# Altium schematic sheet 16_LPDDR.SchDoc
size A3; SheetNumber: 17; SheetTotal: 22
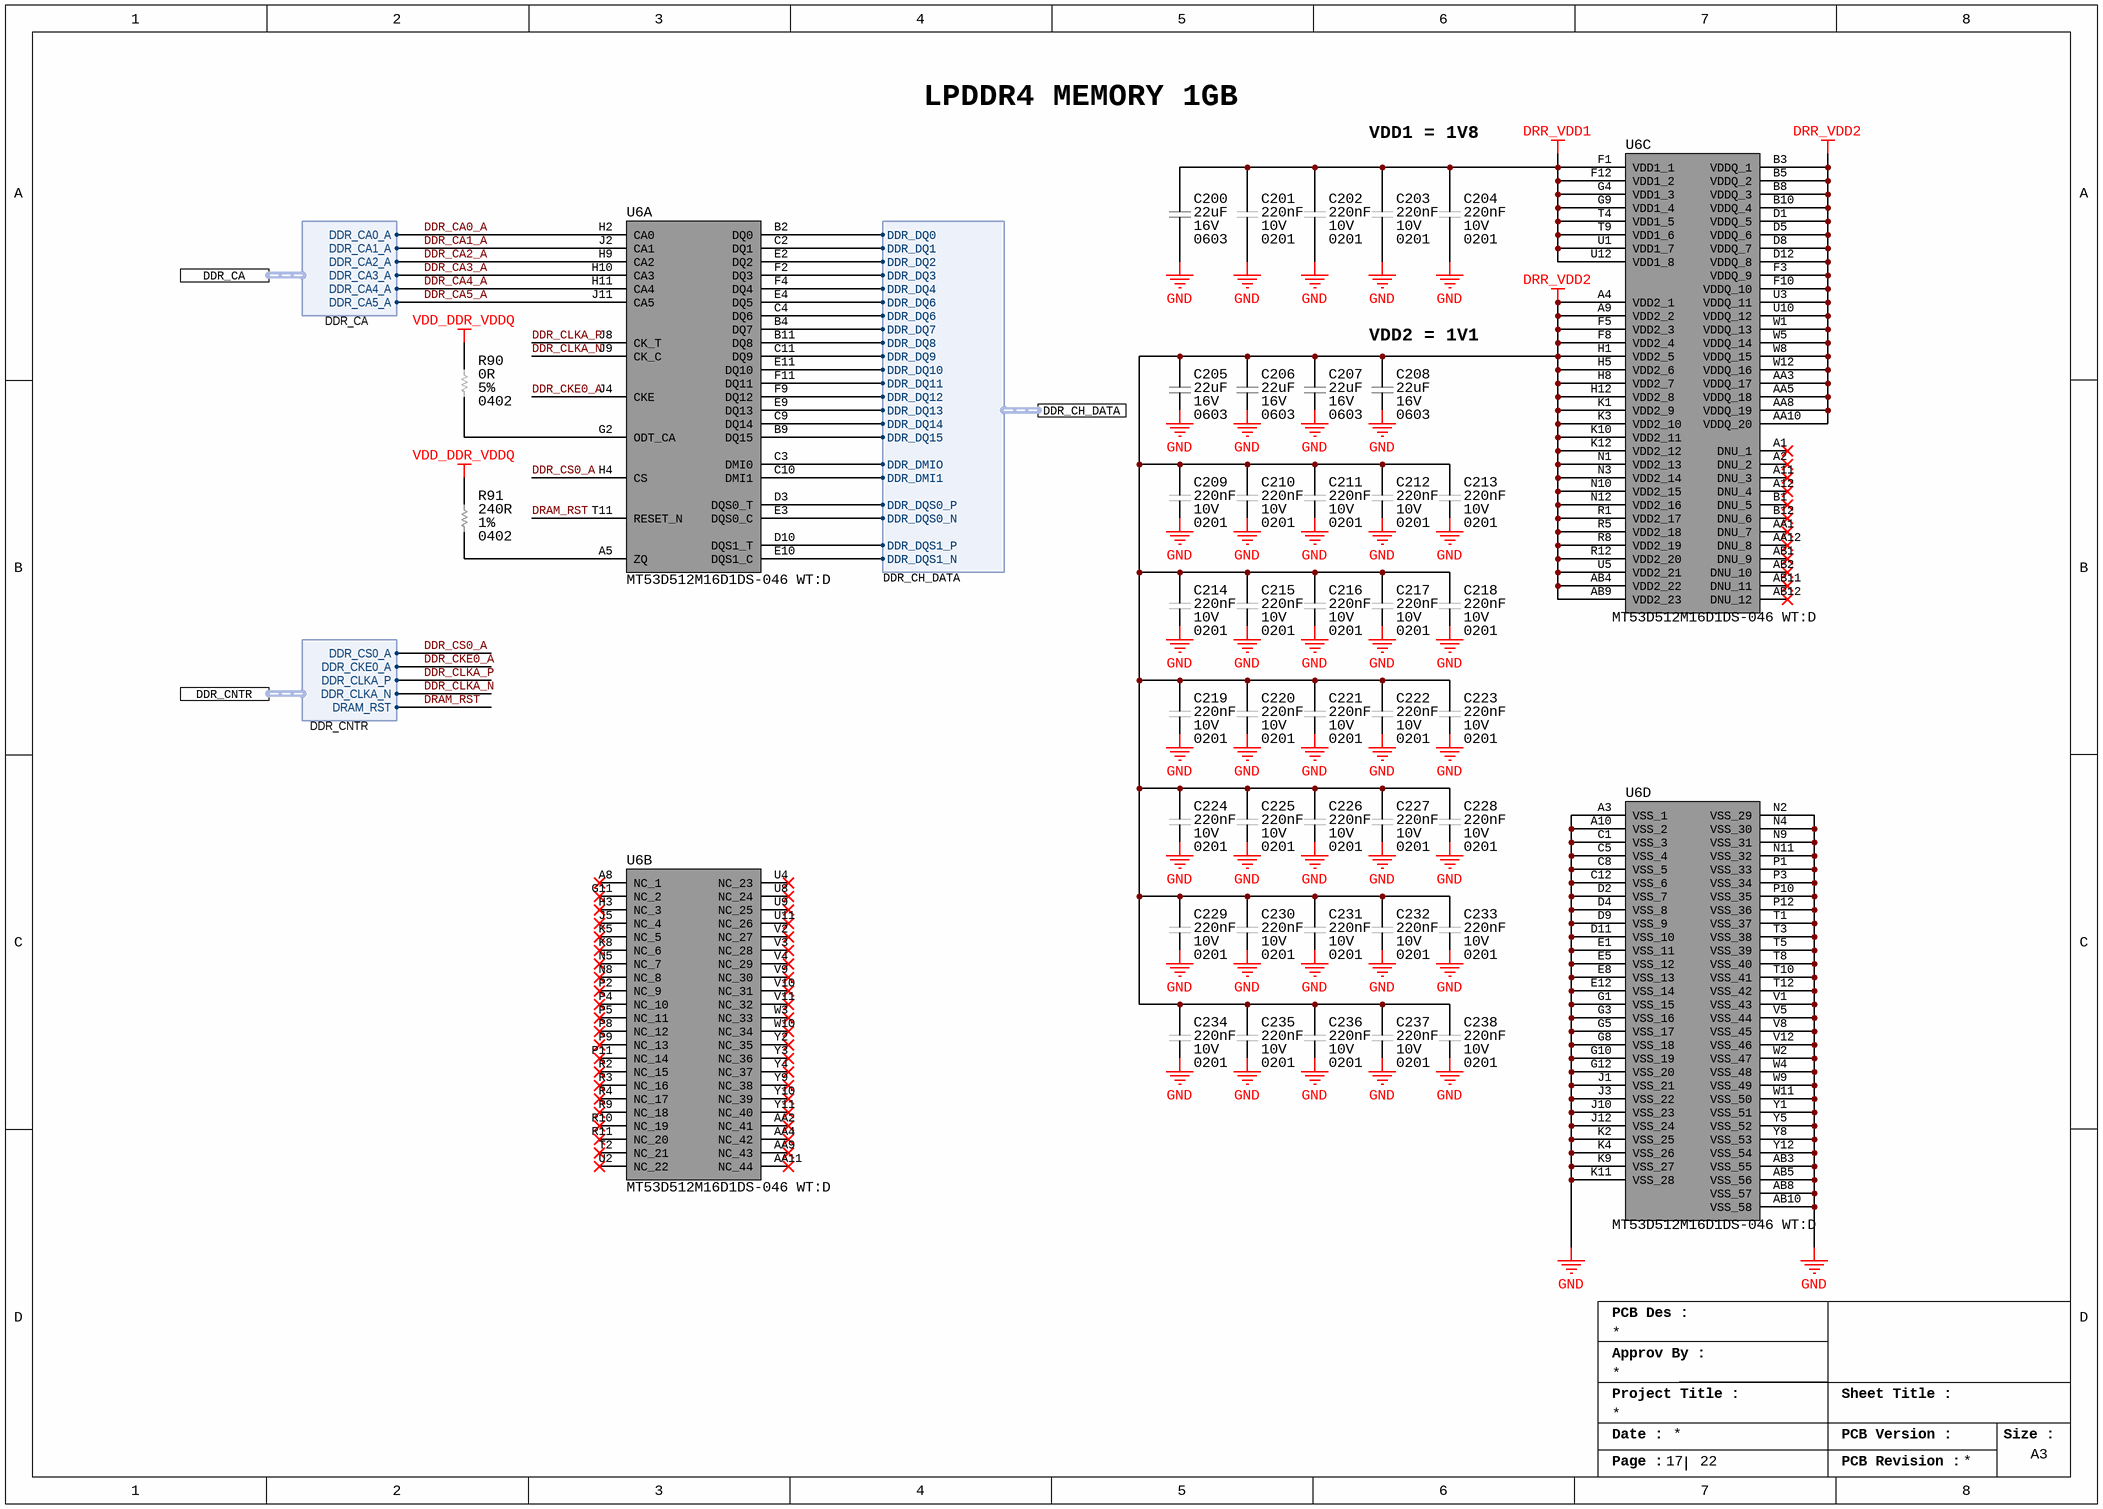
[diagram p0: 16_LPDDR.SchDoc]

## Parts
C200  Capacitance: 22uF  Voltage Rating: 16V  Case/Package: 0603  [CAP_0603_CAPC1608X08N]  (hidden comment: CL10A226MO7JZNC)
C201  Voltage Rating (DC): 10V  Capacitance: 220nF  Case/Package: 0201  [CAP_0201_CAPC0603X03N]  (hidden comment: LMK063BJ224MP-F)
C202  Voltage Rating (DC): 10V  Capacitance: 220nF  Case/Package: 0201  [CAP_0201_CAPC0603X03N]  (hidden comment: LMK063BJ224MP-F)
C203  Voltage Rating (DC): 10V  Capacitance: 220nF  Case/Package: 0201  [CAP_0201_CAPC0603X03N]  (hidden comment: LMK063BJ224MP-F)
C204  Voltage Rating (DC): 10V  Capacitance: 220nF  Case/Package: 0201  [CAP_0201_CAPC0603X03N]  (hidden comment: LMK063BJ224MP-F)
C205  Capacitance: 22uF  Voltage Rating: 16V  Case/Package: 0603  [CAP_0603_CAPC1608X08N]  (hidden comment: CL10A226MO7JZNC)
C206  Capacitance: 22uF  Voltage Rating: 16V  Case/Package: 0603  [CAP_0603_CAPC1608X08N]  (hidden comment: CL10A226MO7JZNC)
C207  Capacitance: 22uF  Voltage Rating: 16V  Case/Package: 0603  [CAP_0603_CAPC1608X08N]  (hidden comment: CL10A226MO7JZNC)
C208  Capacitance: 22uF  Voltage Rating: 16V  Case/Package: 0603  [CAP_0603_CAPC1608X08N]  (hidden comment: CL10A226MO7JZNC)
C209  Voltage Rating (DC): 10V  Capacitance: 220nF  Case/Package: 0201  [CAP_0201_CAPC0603X03N]  (hidden comment: LMK063BJ224MP-F)
C210  Voltage Rating (DC): 10V  Capacitance: 220nF  Case/Package: 0201  [CAP_0201_CAPC0603X03N]  (hidden comment: LMK063BJ224MP-F)
C211  Voltage Rating (DC): 10V  Capacitance: 220nF  Case/Package: 0201  [CAP_0201_CAPC0603X03N]  (hidden comment: LMK063BJ224MP-F)
C212  Voltage Rating (DC): 10V  Capacitance: 220nF  Case/Package: 0201  [CAP_0201_CAPC0603X03N]  (hidden comment: LMK063BJ224MP-F)
C213  Voltage Rating (DC): 10V  Capacitance: 220nF  Case/Package: 0201  [CAP_0201_CAPC0603X03N]  (hidden comment: LMK063BJ224MP-F)
C214  Voltage Rating (DC): 10V  Capacitance: 220nF  Case/Package: 0201  [CAP_0201_CAPC0603X03N]  (hidden comment: LMK063BJ224MP-F)
C215  Voltage Rating (DC): 10V  Capacitance: 220nF  Case/Package: 0201  [CAP_0201_CAPC0603X03N]  (hidden comment: LMK063BJ224MP-F)
C216  Voltage Rating (DC): 10V  Capacitance: 220nF  Case/Package: 0201  [CAP_0201_CAPC0603X03N]  (hidden comment: LMK063BJ224MP-F)
C217  Voltage Rating (DC): 10V  Capacitance: 220nF  Case/Package: 0201  [CAP_0201_CAPC0603X03N]  (hidden comment: LMK063BJ224MP-F)
C218  Voltage Rating (DC): 10V  Capacitance: 220nF  Case/Package: 0201  [CAP_0201_CAPC0603X03N]  (hidden comment: LMK063BJ224MP-F)
C219  Voltage Rating (DC): 10V  Capacitance: 220nF  Case/Package: 0201  [CAP_0201_CAPC0603X03N]  (hidden comment: LMK063BJ224MP-F)
C220  Voltage Rating (DC): 10V  Capacitance: 220nF  Case/Package: 0201  [CAP_0201_CAPC0603X03N]  (hidden comment: LMK063BJ224MP-F)
C221  Voltage Rating (DC): 10V  Capacitance: 220nF  Case/Package: 0201  [CAP_0201_CAPC0603X03N]  (hidden comment: LMK063BJ224MP-F)
C222  Voltage Rating (DC): 10V  Capacitance: 220nF  Case/Package: 0201  [CAP_0201_CAPC0603X03N]  (hidden comment: LMK063BJ224MP-F)
C223  Voltage Rating (DC): 10V  Capacitance: 220nF  Case/Package: 0201  [CAP_0201_CAPC0603X03N]  (hidden comment: LMK063BJ224MP-F)
C224  Voltage Rating (DC): 10V  Capacitance: 220nF  Case/Package: 0201  [CAP_0201_CAPC0603X03N]  (hidden comment: LMK063BJ224MP-F)
C225  Voltage Rating (DC): 10V  Capacitance: 220nF  Case/Package: 0201  [CAP_0201_CAPC0603X03N]  (hidden comment: LMK063BJ224MP-F)
C226  Voltage Rating (DC): 10V  Capacitance: 220nF  Case/Package: 0201  [CAP_0201_CAPC0603X03N]  (hidden comment: LMK063BJ224MP-F)
C227  Voltage Rating (DC): 10V  Capacitance: 220nF  Case/Package: 0201  [CAP_0201_CAPC0603X03N]  (hidden comment: LMK063BJ224MP-F)
C228  Voltage Rating (DC): 10V  Capacitance: 220nF  Case/Package: 0201  [CAP_0201_CAPC0603X03N]  (hidden comment: LMK063BJ224MP-F)
C229  Voltage Rating (DC): 10V  Capacitance: 220nF  Case/Package: 0201  [CAP_0201_CAPC0603X03N]  (hidden comment: LMK063BJ224MP-F)
C230  Voltage Rating (DC): 10V  Capacitance: 220nF  Case/Package: 0201  [CAP_0201_CAPC0603X03N]  (hidden comment: LMK063BJ224MP-F)
C231  Voltage Rating (DC): 10V  Capacitance: 220nF  Case/Package: 0201  [CAP_0201_CAPC0603X03N]  (hidden comment: LMK063BJ224MP-F)
C232  Voltage Rating (DC): 10V  Capacitance: 220nF  Case/Package: 0201  [CAP_0201_CAPC0603X03N]  (hidden comment: LMK063BJ224MP-F)
C233  Voltage Rating (DC): 10V  Capacitance: 220nF  Case/Package: 0201  [CAP_0201_CAPC0603X03N]  (hidden comment: LMK063BJ224MP-F)
C234  Voltage Rating (DC): 10V  Capacitance: 220nF  Case/Package: 0201  [CAP_0201_CAPC0603X03N]  (hidden comment: LMK063BJ224MP-F)
C235  Voltage Rating (DC): 10V  Capacitance: 220nF  Case/Package: 0201  [CAP_0201_CAPC0603X03N]  (hidden comment: LMK063BJ224MP-F)
C236  Voltage Rating (DC): 10V  Capacitance: 220nF  Case/Package: 0201  [CAP_0201_CAPC0603X03N]  (hidden comment: LMK063BJ224MP-F)
C237  Voltage Rating (DC): 10V  Capacitance: 220nF  Case/Package: 0201  [CAP_0201_CAPC0603X03N]  (hidden comment: LMK063BJ224MP-F)
C238  Voltage Rating (DC): 10V  Capacitance: 220nF  Case/Package: 0201  [CAP_0201_CAPC0603X03N]  (hidden comment: LMK063BJ224MP-F)
R90  Case Code (Imperial): 0402  Tolerance: 5%  Resistance: 0R  [RES_0402_RESC1005X04N]  (hidden comment: ERJ-2GE0R00X)
R91  Tolerance: 1%  Resistance: 240R  Case/Package: 0402  [RES_0402_RESC1005X04N]  (hidden comment: RC0402FR-07240RL)
U6  MT53D512M16D1DS-046 WT:D  [BGA200C65P12X22_1000X1450X80]  (parts A,B,C,D of 4)

## Ports
DDR_CA (harness DDR_CA), DDR_CH_DATA (harness DDR_CH_DATA), DDR_CNTR (harness DDR_CNTR)

## Harnesses
DDR_CH_DATA: DDR_DQ0, DDR_DQ1, DDR_DQ2, DDR_DQ3, DDR_DQ4, DDR_DQ6, DDR_DQ6, DDR_DQ7, DDR_DQS0_P, DDR_DQS0_N, DDR_DMIO, DDR_DQ8, DDR_DQ9, DDR_DQ10, DDR_DQ11, DDR_DQ12, DDR_DQ13, DDR_DQ14, DDR_DQ15, DDR_DQS1_P, DDR_DQS1_N, DDR_DMI1
DDR_CA: DDR_CA0_A, DDR_CA1_A, DDR_CA2_A, DDR_CA3_A, DDR_CA4_A, DDR_CA5_A
DDR_CNTR: DDR_CS0_A, DDR_CKE0_A, DDR_CLKA_P, DDR_CLKA_N, DRAM_RST

## Nets
DRR_VDD1: C200.2 C201.1 C202.1 C203.1 C204.1 U6.F1(VDD1_1) U6.F12(VDD1_2) U6.G4(VDD1_3) U6.G9(VDD1_4) U6.T4(VDD1_5) U6.T9(VDD1_6) U6.U1(VDD1_7) U6.U12(VDD1_8)
DRR_VDD2: C205.2 C206.2 C207.2 C208.2 C209.1 C210.1 C211.1 C212.1 C213.1 C214.1 C215.1 C216.1 C217.1 C218.1 C219.1 C220.1 C221.1 C222.1 C223.1 C224.1 C225.1 C226.1 C227.1 C228.1 C229.1 C230.1 C231.1 C232.1 C233.1 C234.1 C235.1 C236.1 C237.1 C238.1 U6.A4(VDD2_1) U6.A9(VDD2_2) U6.AA3(VDDQ_17) U6.AA5(VDDQ_18) U6.AA8(VDDQ_19) U6.AA10(VDDQ_20) U6.AB4(VDD2_22) U6.AB9(VDD2_23) U6.B3(VDDQ_1) U6.B5(VDDQ_2) U6.B8(VDDQ_3) U6.B10(VDDQ_4) U6.D1(VDDQ_5) U6.D5(VDDQ_6) U6.D8(VDDQ_7) U6.D12(VDDQ_8) U6.F3(VDDQ_9) U6.F5(VDD2_3) U6.F8(VDD2_4) U6.F10(VDDQ_10) U6.H1(VDD2_5) U6.H5(VDD2_6) U6.H8(VDD2_7) U6.H12(VDD2_8) U6.K1(VDD2_9) U6.K3(VDD2_10) U6.K10(VDD2_11) U6.K12(VDD2_12) U6.N1(VDD2_13) U6.N3(VDD2_14) U6.N10(VDD2_15) U6.N12(VDD2_16) U6.R1(VDD2_17) U6.R5(VDD2_18) U6.R8(VDD2_19) U6.R12(VDD2_20) U6.U3(VDDQ_11) U6.U5(VDD2_21) U6.U10(VDDQ_12) U6.W1(VDDQ_13) U6.W5(VDDQ_14) U6.W8(VDDQ_15) U6.W12(VDDQ_16)
GND: C200.1 C201.2 C202.2 C203.2 C204.2 C205.1 C206.1 C207.1 C208.1 C209.2 C210.2 C211.2 C212.2 C213.2 C214.2 C215.2 C216.2 C217.2 C218.2 C219.2 C220.2 C221.2 C222.2 C223.2 C224.2 C225.2 C226.2 C227.2 C228.2 C229.2 C230.2 C231.2 C232.2 C233.2 C234.2 C235.2 C236.2 C237.2 C238.2 U6.A3(VSS_1) U6.A10(VSS_2) U6.AB3(VSS_55) U6.AB5(VSS_56) U6.AB8(VSS_57) U6.AB10(VSS_58) U6.C1(VSS_3) U6.C5(VSS_4) U6.C8(VSS_5) U6.C12(VSS_6) U6.D2(VSS_7) U6.D4(VSS_8) U6.D9(VSS_9) U6.D11(VSS_10) U6.E1(VSS_11) U6.E5(VSS_12) U6.E8(VSS_13) U6.E12(VSS_14) U6.G1(VSS_15) U6.G3(VSS_16) U6.G5(VSS_17) U6.G8(VSS_18) U6.G10(VSS_19) U6.G12(VSS_20) U6.J1(VSS_21) U6.J3(VSS_22) U6.J10(VSS_23) U6.J12(VSS_24) U6.K2(VSS_25) U6.K4(VSS_26) U6.K9(VSS_27) U6.K11(VSS_28) U6.N2(VSS_29) U6.N4(VSS_30) U6.N9(VSS_31) U6.N11(VSS_32) U6.P1(VSS_33) U6.P3(VSS_34) U6.P10(VSS_35) U6.P12(VSS_36) U6.T1(VSS_37) U6.T3(VSS_38) U6.T5(VSS_39) U6.T8(VSS_40) U6.T10(VSS_41) U6.T12(VSS_42) U6.V1(VSS_43) U6.V5(VSS_44) U6.V8(VSS_45) U6.V12(VSS_46) U6.W2(VSS_47) U6.W4(VSS_48) U6.W9(VSS_49) U6.W11(VSS_50) U6.Y1(VSS_51) U6.Y5(VSS_52) U6.Y8(VSS_53) U6.Y12(VSS_54)
VDD_DDR_VDDQ: R90.2 R91.2
DDR_CA0_A: U6.H2(CA0) ; port DDR_CA.DDR_CA0_A
DDR_CA1_A: U6.J2(CA1) ; port DDR_CA.DDR_CA1_A
DDR_CA2_A: U6.H9(CA2) ; port DDR_CA.DDR_CA2_A
DDR_CA3_A: U6.H10(CA3) ; port DDR_CA.DDR_CA3_A
DDR_CA4_A: U6.H11(CA4) ; port DDR_CA.DDR_CA4_A
DDR_CA5_A: U6.J11(CA5) ; port DDR_CA.DDR_CA5_A
DDR_CKE0_A: U6.J4(CKE) ; port DDR_CNTR.DDR_CKE0_A
DDR_CLKA_N: U6.J9(CK_C) ; port DDR_CNTR.DDR_CLKA_N
DDR_CLKA_P: U6.J8(CK_T) ; port DDR_CNTR.DDR_CLKA_P
DDR_CS0_A: U6.H4(CS) ; port DDR_CNTR.DDR_CS0_A
DRAM_RST: U6.T11(RESET_N) ; port DDR_CNTR.DRAM_RST
NetR90_1: R90.1 U6.G2(ODT_CA)
NetR91_1: R91.1 U6.A5(ZQ)
NetU6_B2: U6.B2(DQ0) ; port DDR_CH_DATA.DDR_DQ0
NetU6_B4: U6.B4(DQ7) ; port DDR_CH_DATA.DDR_DQ7
NetU6_B9: U6.B9(DQ15) ; port DDR_CH_DATA.DDR_DQ15
NetU6_B11: U6.B11(DQ8) ; port DDR_CH_DATA.DDR_DQ8
NetU6_C2: U6.C2(DQ1) ; port DDR_CH_DATA.DDR_DQ1
NetU6_C3: U6.C3(DMI0) ; port DDR_CH_DATA.DDR_DMIO
NetU6_C4: U6.C4(DQ6) U6.E4(DQ5) ; port DDR_CH_DATA.DDR_DQ6
NetU6_C9: U6.C9(DQ14) ; port DDR_CH_DATA.DDR_DQ14
NetU6_C10: U6.C10(DMI1) ; port DDR_CH_DATA.DDR_DMI1
NetU6_C11: U6.C11(DQ9) ; port DDR_CH_DATA.DDR_DQ9
NetU6_D3: U6.D3(DQS0_T) ; port DDR_CH_DATA.DDR_DQS0_P
NetU6_D10: U6.D10(DQS1_T) ; port DDR_CH_DATA.DDR_DQS1_P
NetU6_E2: U6.E2(DQ2) ; port DDR_CH_DATA.DDR_DQ2
NetU6_E3: U6.E3(DQS0_C) ; port DDR_CH_DATA.DDR_DQS0_N
NetU6_E9: U6.E9(DQ13) ; port DDR_CH_DATA.DDR_DQ13
NetU6_E10: U6.E10(DQS1_C) ; port DDR_CH_DATA.DDR_DQS1_N
NetU6_E11: U6.E11(DQ10) ; port DDR_CH_DATA.DDR_DQ10
NetU6_F2: U6.F2(DQ3) ; port DDR_CH_DATA.DDR_DQ3
NetU6_F4: U6.F4(DQ4) ; port DDR_CH_DATA.DDR_DQ4
NetU6_F9: U6.F9(DQ12) ; port DDR_CH_DATA.DDR_DQ12
NetU6_F11: U6.F11(DQ11) ; port DDR_CH_DATA.DDR_DQ11

Not connected (* = marked no-connect by the designer): U6 A1(DNU_1)* A2(DNU_2)* A8(NC_1)* A11(DNU_3)* A12(DNU_4)* AA1(DNU_7)* AA2(NC_41)* AA4(NC_42)* AA9(NC_43)* AA11(NC_44)* AA12(DNU_8)* AB1(DNU_9)* AB2(DNU_10)* AB11(DNU_11)* AB12(DNU_12)* B1(DNU_5)* B12(DNU_6)* G11(NC_2)* H3(NC_3)* J5(NC_4)* K5(NC_5)* K8(NC_6)* N5(NC_7)* N8(NC_8)* P2(NC_9)* P4(NC_10)* P5(NC_11)* P8(NC_12)* P9(NC_13)* P11(NC_14)* R2(NC_15)* R3(NC_16)* R4(NC_17)* R9(NC_18)* R10(NC_19)* R11(NC_20)* T2(NC_21)* U2(NC_22)* U4(NC_23)* U8(NC_24)* U9(NC_25)* U11(NC_26)* V2(NC_27)* V3(NC_28)* V4(NC_29)* V9(NC_30)* V10(NC_31)* V11(NC_32)* W3(NC_33)* W10(NC_34)* Y2(NC_35)* Y3(NC_36)* Y4(NC_37)* Y9(NC_38)* Y10(NC_39)* Y11(NC_40)*

## Notes on the sheet
- LPDDR4 MEMORY 1GB
- VDD1 = 1V8
- (near C208) VDD2 = 1V1
- PCB Des :
- Approv By :
- Project Title :
- Sheet Title :
- Date :
- PCB Version :
- Size :
- A3
- Page :
- PCB Revision :

## Library data of the parts
C200 C205-C208 = CAP_22UF_16V_X5R_0603: Cap Ceramic 22uF 16V X5R 20% Pad SMD 0603 85C T/R; Manufacturer: Samsung; Supplier 1: Digi-Key; Manufacturer Part Number: CL10A226MO7JZNC; RoHS: Yes; Category: Ceramic Capacitors; Stock 1: 1760065; Pricing 1: 1=0.59, 10=0.419, 50=0.3164, 100=0.2756, 500=0.20418, 1000=0.17355 (USD); Mount: Surface Mount; Case Code (Imperial): 0603; Case Code (Metric): 1608; Min Operating Temperature: -55°C; Max Operating Temperature: 85°C; Packaging: Cut Tape; Tolerance: 20%; Series: CL; RoHS Compliant: Yes; ComponentLink1URL: http://www.samsungsem.com/kr/support/product-search/mlcc/CL10A226MO7JZNC.jsp?src-supplier=Digi-Key; ComponentLink1Description: http://www.samsungsem.com/kr/support/product-search/mlcc/CL10A226MO7JZNC.jsp?src-supplier=Digi-Key; ComponentLink2URL: https://datasheet.octopart.com/CL10A226MO7JZNC-Samsung-Electro-Mechanics-datasheet-149156497.pdf?src-supplier=Future+Electronics; ComponentLink2Description: https://datasheet.octopart.com/CL10A226MO7JZNC-Samsung-Electro-Mechanics-datasheet-149156497.pdf?src-supplier=Future+Electronics; Supplier Part Number 1: 1276-7076-1-ND
C201-C204 C209-C238 = CAP_0.22UF_10V_X5R_0201: Multilayer Ceramic Capacitors (High dielectric type), 10V, 0.22 uF, ± 20 %, 0201, X5R, RoHS; Manufacturer: Taiyo Yuden; Material: 4241ConductorMaterial; Tolerance: 20%; Supplier 1: Digikey; Manufacturer Part Number: LMK063BJ224MP-F; RoHS: Yes; Category: Ceramic Capacitors; Stock 1: 6053224; Pricing 1: 1=0.12, 10=0.08, 50=0.0478, 100=0.0375, 500=0.02772, 1000=0.02295, 2500=0.02136, 5000=0.01954 (USD); Mount: Surface Mount; Case Code (Metric): 0603; Case Code (Imperial): 0201; Min Operating Temperature: -55°C; Max Operating Temperature: 85°C; Voltage Rating: 10V; Packaging: Tape and Reel; Package Quantity: 15000; Dielectric: X5R; Termination: SMD/SMT; Voltage: 10V; Series: M; Construction: Flat; Length: 0.6mm; Width: 0.3mm; Height: 0.3mm; Depth: 0.3mm; Radiation Hardening: No; Halogen Free: Halogen Free; RoHS Compliant: Yes; Reach SVHC Compliant: Unknown; ComponentLink1URL: https://datasheet.ciiva.com/134/lmk063bj224mp-f-ss-134995.pdf?src-supplier=Digikey; ComponentLink1Description: https://datasheet.ciiva.com/134/lmk063bj224mp-f-ss-134995.pdf?src-supplier=Digikey; ComponentLink2URL: https://datasheet.ciiva.com/11464/lmk063bj224mp-f-ss-11464053.pdf?src-supplier=Avnet; ComponentLink2Description: https://datasheet.ciiva.com/11464/lmk063bj224mp-f-ss-11464053.pdf?src-supplier=Avnet; ComponentLink3URL: https://datasheet.ciiva.com/15921/1589lmk063bj224mp-f-15921250.pdf?src-supplier=Onlinecomponents.com; ComponentLink3Description: https://datasheet.ciiva.com/15921/1589lmk063bj224mp-f-15921250.pdf?src-supplier=Onlinecomponents.com; ComponentLink4URL: https://datasheet.ciiva.com/26872/getdatasheetpartid-639019-26872592.pdf?src-supplier=Verical; ComponentLink4Description: https://datasheet.ciiva.com/26872/getdatasheetpartid-639019-26872592.pdf?src-supplier=Verical; ComponentLink5URL: https://datasheet.ciiva.com/30243/100lmk063bj224mp-f-30243150.pdf?src-supplier=Onlinecomponents.com; ComponentLink5Description: https://datasheet.ciiva.com/30243/100lmk063bj224mp-f-30243150.pdf?src-supplier=Onlinecomponents.com; ComponentLink6URL: https://datasheet.ciiva.com/28645/746258-28645141.pdf?src-supplier=Element14; ComponentLink6Description: https://datasheet.ciiva.com/28645/746258-28645141.pdf?src-supplier=Element14; ComponentLink7URL: https://datasheet.ciiva.com/5422/mlcc-all-e-541559-5422365.pdf?src-supplier=Mouser; ComponentLink7Description: https://datasheet.ciiva.com/5422/mlcc-all-e-541559-5422365.pdf?src-supplier=Mouser; Supplier Part Number 1: 587-2483-1-ND
R90 = RES_0R_5%_100mW_0402: SMD Chip Resistor, Jumper, 0 ohm, 100 mW, 0402 [1005 Metric], Thick Film, General Purpose; Manufacturer: Panasonic; Power Rating: 100mW; Voltage Rating: 50V; Temperature Coefficient: 600ppm/°C; Supplier 1: Mouser; Manufacturer Part Number: ERJ-2GE0R00X; RoHS: Yes; Category: Chip SMD Resistors; Stock 1: 10989354; Pricing 1: 1=0.1, 10=0.013, 50=0.013, 100=0.006, 1000=0.004, 2500=0.003, 10000=0.003 (USD); Mount: Surface Mount; Case/Package: 0402; Contact Plating: Tin; Case Code (Metric): 1005; Size Code: 0402; Min Operating Temperature: -55°C; Max Operating Temperature: 155°C; Resistor Type: Thick Film; Packaging: Cut Tape; Package Quantity: 10000; Number of Terminations: 2; Termination: SMD/SMT; Max Power Dissipation: 100mW; Voltage Rating (DC): 50V; Features: Automotive AEC-Q200; Series: ERJ; Construction: Rectangular; Technology: THICK FILM; Length: 1mm; Width: 0.5mm; Height: 0.35mm; Depth: 0.5mm; Ratings: AEC-Q200; Radiation Hardening: No; Reach SVHC Compliant: No; Military Standard: Not; Lead Free: Lead Free; RoHS Compliant: Yes; ComponentLink1URL: https://datasheet.ciiva.com/11821/0900766b80f806dd-11821176.pdf?src-supplier=Rs; ComponentLink1Description: https://datasheet.ciiva.com/11821/0900766b80f806dd-11821176.pdf?src-supplier=Rs; ComponentLink2URL: https://datasheet.ciiva.com/43460/1678796-43460347.pdf?src-supplier=Farnell; ComponentLink2Description: https://datasheet.ciiva.com/43460/1678796-43460347.pdf?src-supplier=Farnell; ComponentLink3URL: https://datasheet.ciiva.com/46389/1678796-46389518.pdf?src-supplier=Element14; ComponentLink3Description: https://datasheet.ciiva.com/46389/1678796-46389518.pdf?src-supplier=Element14; ComponentLink4URL: https://datasheet.ciiva.com/5959/1678796-5959692.pdf?src-supplier=Farnell; ComponentLink4Description: https://datasheet.ciiva.com/5959/1678796-5959692.pdf?src-supplier=Farnell; ComponentLink5URL: https://datasheet.ciiva.com/28695/1678796-28695758.pdf?src-supplier=Element14; ComponentLink5Description: https://datasheet.ciiva.com/28695/1678796-28695758.pdf?src-supplier=Element14; ComponentLink6URL: https://datasheet.ciiva.com/16783/70260739-16783734.pdf?src-supplier=Allied+Electronics; ComponentLink6Description: https://datasheet.ciiva.com/16783/70260739-16783734.pdf?src-supplier=Allied+Electronics; ComponentLink7URL: https://datasheet.ciiva.com/16778/70260739-16778335.pdf?src-supplier=Allied+Electronics; ComponentLink7Description: https://datasheet.ciiva.com/16778/70260739-16778335.pdf?src-supplier=Allied+Electronics; ComponentLink8URL: https://datasheet.ciiva.com/48531/aoa0000ce1-48531077.pdf?src-supplier=Avnet; ComponentLink8Description: https://datasheet.ciiva.com/48531/aoa0000ce1-48531077.pdf?src-supplier=Avnet; ComponentLink9URL: https://datasheet.ciiva.com/30097/4aoa0000ce1-30097116.pdf?src-supplier=Onlinecomponents.com; ComponentLink9Description: https://datasheet.ciiva.com/30097/4aoa0000ce1-30097116.pdf?src-supplier=Onlinecomponents.com; Supplier Part Number 1: 667-ERJ-2GE0R00X
R91 = RES_240R_1%_63mW_0402: SMD Chip Resistor, 240 Ohm, ± 1%, 63 mW, 0402 [1005 Metric], Thick Film, General Purpose; Manufacturer: Yageo; Power Rating: 63mW; Voltage Rating: 50V; Temperature Coefficient: 100ppm/°C; Supplier 1: Digi-Key; Manufacturer Part Number: RC0402FR-07240RL; RoHS: Yes; Category: Chip SMD Resistors; Stock 1: 1880273; Pricing 1: 1=0.1, 10=0.014, 50=0.0084, 100=0.007, 500=0.00464, 1000=0.00396, 5000=0.00282 (USD); Case Code (Metric): 1005; Case Code (Imperial): 0402; Size Code: 0402; Min Operating Temperature: -55°C; Max Operating Temperature: 155°C; Resistor Type: Thick Film; Packaging: Tape and Reel; Number of Terminations: 2; Termination: SMD/SMT; Max Power Dissipation: 63mW; Voltage Rating (DC): 50V; Features: Moisture Resistant; Series: RC; Construction: Rectangular; Resistance Tolerance: 1%; Length: 1mm; Depth: 0.5mm; RoHS Compliant: Yes; Military Standard: Not; Lead Free: Lead Free; Reach SVHC Compliant: Unknown; ComponentLink1URL: https://datasheet.ciiva.com/7849/1018594-7849915.pdf?src-supplier=Element14; ComponentLink1Description: https://datasheet.ciiva.com/7849/1018594-7849915.pdf?src-supplier=Element14; ComponentLink2URL: https://datasheet.ciiva.com/7849/1018594-7849916.pdf?src-supplier=Element14; ComponentLink2Description: https://datasheet.ciiva.com/7849/1018594-7849916.pdf?src-supplier=Element14; ComponentLink3URL: https://datasheet.ciiva.com/2519/pyu-r-int-thick-7-2519158.pdf?src-supplier=Digi-Key; ComponentLink3Description: https://datasheet.ciiva.com/2519/pyu-r-int-thick-7-2519158.pdf?src-supplier=Digi-Key; ComponentLink4URL: https://datasheet.ciiva.com/2519/pyu-r-int-thick-7-2519157.pdf?src-supplier=Digi-Key; ComponentLink4Description: https://datasheet.ciiva.com/2519/pyu-r-int-thick-7-2519157.pdf?src-supplier=Digi-Key; ComponentLink5URL: https://datasheet.ciiva.com/2519/pyu-r-int-thick-7-2519156.pdf?src-supplier=Digi-Key; ComponentLink5Description: https://datasheet.ciiva.com/2519/pyu-r-int-thick-7-2519156.pdf?src-supplier=Digi-Key; ComponentLink6URL: https://datasheet.ciiva.com/12669/pyu-rc0402-51-rohs-l-6-r-12669689.pdf?src-supplier=Mouser; ComponentLink6Description: https://datasheet.ciiva.com/12669/pyu-rc0402-51-rohs-l-6-r-12669689.pdf?src-supplier=Mouser; ComponentLink7URL: https://datasheet.ciiva.com/17419/pyu-rc0402-51-rohs-l-6-r-17419482.pdf?src-supplier=Future+Electronics; ComponentLink7Description: https://datasheet.ciiva.com/17419/pyu-rc0402-51-rohs-l-6-r-17419482.pdf?src-supplier=Future+Electronics; Supplier Part Number 1: 311-240LRCT-ND
U6 = IC_DRAM_8Gb_MT53D512M16D1DS-046 WT:D: Active Volatile ROHS3Compliant Automotive AEC-Q100 ic memory -30C~85C TC 8Gb 512M x 16 2.133GHz; Manufacturer: Micron Technology; Max Supply Current: 360mA; Max Supply Voltage: 1.17V; Min Supply Voltage: 1.06V; Number of Circuits: 1NUMBER; Operating Supply Voltage: 1.1V; Supplier 1: Digikey; Manufacturer Part Number: MT53D512M16D1DS-046 WT:D; RoHS: No; Category: Memory; Stock 1: 1200; Pricing 1: 1=9.81, 10=9.115, 25=8.834, 50=8.6224, 100=8.4121, 250=8.13712, 500=7.93238 (USD); Mount: Surface Mount; Number of Pins: 200; Min Operating Temperature: -30°C; Max Operating Temperature: 85°C; Memory Type: Volatile; Series: Automotive, AEC-Q100; Packaging: Tray; Memory Size: 8Gb; Frequency: 2.133GHz; Number of Ports: 1NUMBER; Length: 14.5mm; Width: 10mm; Height - Seated (Max): 800um; Terminal Pitch: 800um; Reach SVHC Compliant: 4188SVHC; ComponentLink1URL: https://datasheet.octopart.com/MT53D512M16D1DS-046-WT%3AD-Micron-datasheet-165827613.pdf?src-supplier=Farnell; ComponentLink1Description: https://datasheet.octopart.com/MT53D512M16D1DS-046-WT%3AD-Micron-datasheet-165827613.pdf?src-supplier=Farnell; Supplier Part Number 1: MT53D512M16D1DS-046WT:D-ND